# EAGLE board airlight (EAGLE 6.4)
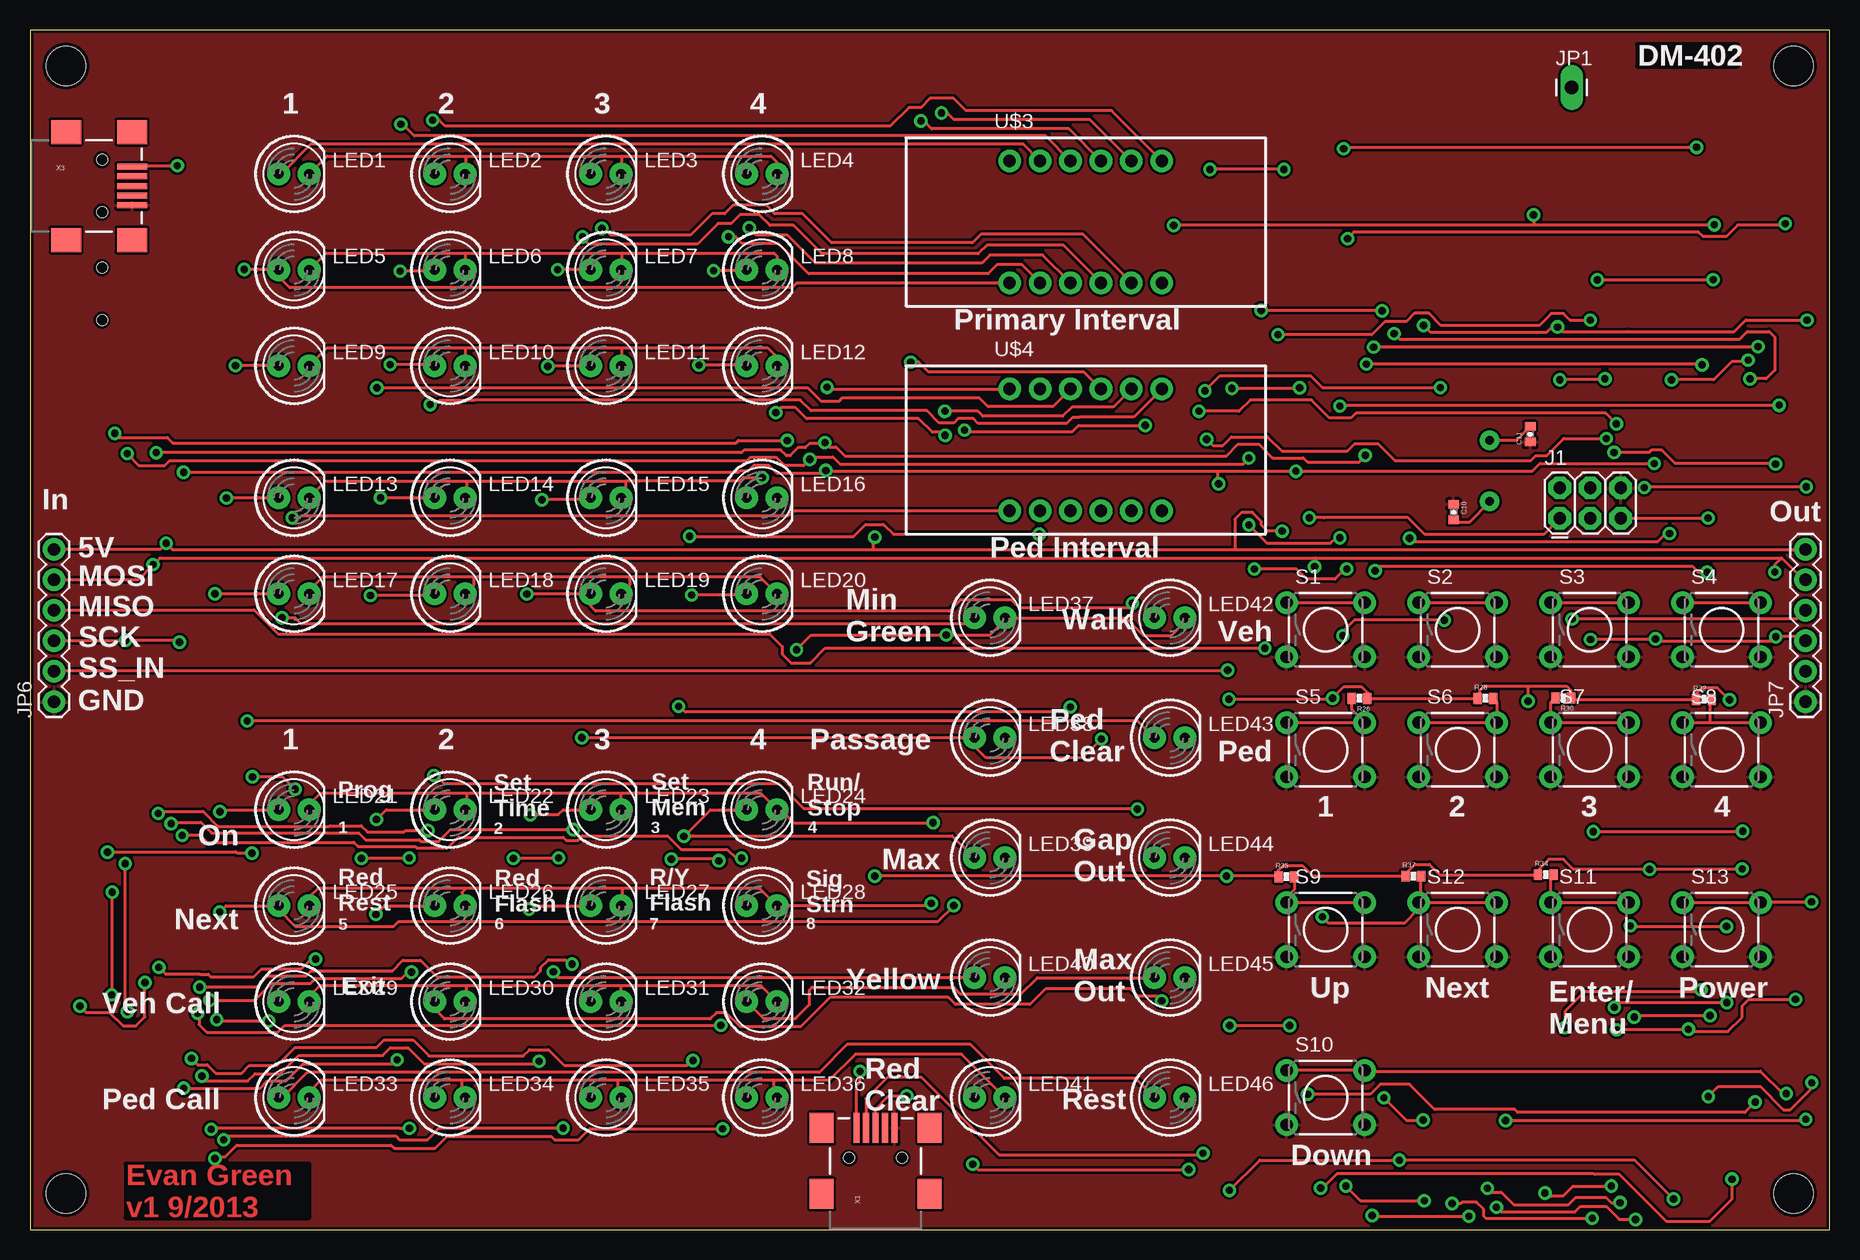
[diagram p3: board, top side]
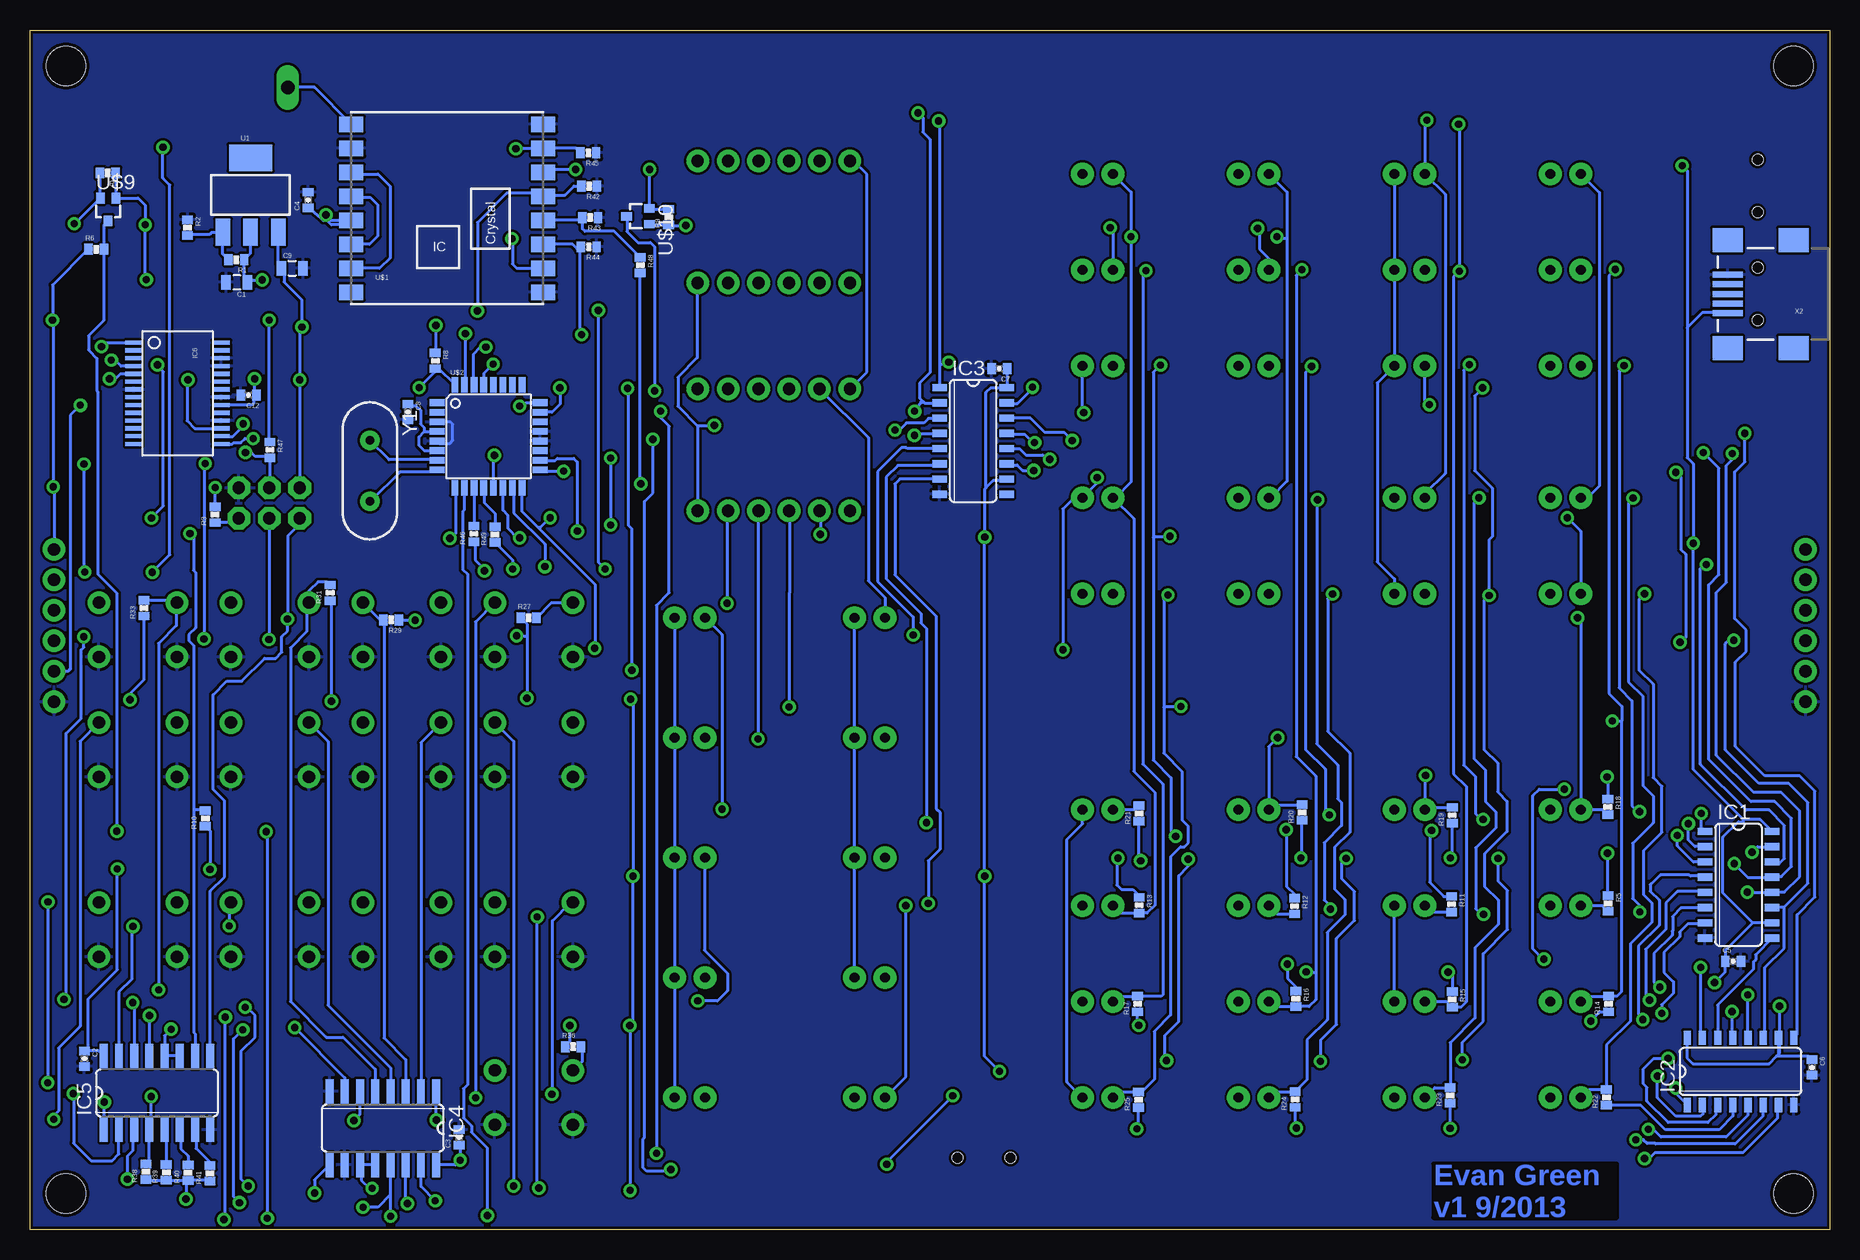
[diagram p4: board, bottom side, seen from below]

Size 150 x 100 mm. Coordinates in mm from the lower left corner, seen from the top.
Outline: 0,0 150,0 150,100 0,100 0,0
Copper layers (1*16): Top 0.035mm / dielectric 1.5mm / Bottom 0.035mm
Design rules "SparkFun": minimum track width 8mil, minimum drill 20mil, track to track 8mil, track to pad 8mil, pad to pad 8mil, via to via 8mil, smd to smd 8mil, copper to edge 10mil, drill to drill 8mil, minimum pad ring 12mil, minimum via ring 10mil, stop-mask expansion 4mil, vias tented up to drill 25mil, thermal gap 10mil

## Footprints (pad centres in the part's own frame; a part is rotated, then mirrored left to right if it is on the bottom)
0805 = smd 0.8 x 1.2: 1 -0.9,0; 2 0.9,0
0402-CAP = smd 0.7 x 0.9: 1 -0.65,0; 2 0.65,0
SO16 = smd 0.6 x 1.2: 1 -4.445,-2.8; 2 -3.175,-2.8; 3 -1.905,-2.8; 4 -0.635,-2.8; 5 0.635,-2.8; 6 1.905,-2.8; 7 3.175,-2.8; 8 4.445,-2.8; 9 4.445,2.8; 10 3.175,2.8; 11 1.905,2.8; 12 0.635,2.8; 13 -0.635,2.8; 14 -1.905,2.8; 15 -3.175,2.8; 16 -4.445,2.8
SO16' = smd 0.66 x 2.032: 1 -4.445,-3.073; 2 -3.175,-3.073; 3 -1.905,-3.073; 4 -0.635,-3.073; 5 0.635,-3.073; 6 1.905,-3.073; 7 3.175,-3.073; 8 4.445,-3.073; 9 4.445,3.073; 10 3.175,3.073; 11 1.905,3.073; 12 0.635,3.073; 13 -0.635,3.073; 14 -1.905,3.073; 15 -3.175,3.073; 16 -4.445,3.073
SSOP28DB = smd 0.348 x 1.397: 1 -4.225,-3.656; 2 -3.575,-3.656; 3 -2.925,-3.656; 4 -2.275,-3.656; 5 -1.625,-3.656; 6 -0.975,-3.656; 7 -0.325,-3.656; 8 0.325,-3.656; 9 0.975,-3.656; 10 1.625,-3.656; 11 2.275,-3.656; 12 2.925,-3.656; 13 3.575,-3.656; 14 4.225,-3.656; 15 4.225,3.656; 16 3.575,3.656; 17 2.925,3.656; 18 2.275,3.656; 19 1.625,3.656; 20 0.975,3.656; 21 0.325,3.656; 22 -0.325,3.656; 23 -0.975,3.656; 24 -1.625,3.656; 25 -2.275,3.656; 26 -2.925,3.656; 27 -3.575,3.656; 28 -4.225,3.656
2X3 = drill 1.016 pad 1.88 octagon: 1 0,0; 2 0,2.54; 3 2.54,0; 4 2.54,2.54; 5 5.08,0; 6 5.08,2.54
1X01_LONGPAD = drill 1.118 pad 1.88 long: 1 0,0
STAND-OFF = hole 3.302: 0,0
1X06 = drill 1.016 pad 1.88: 1 0,0; 2 2.54,0; 3 5.08,0; 4 7.62,0; 5 10.16,0; 6 12.7,0
LED5MM = drill 0.813 pad 1.88: A -1.27,0; K 1.27,0
0402-RES = smd 0.7 x 0.9: 1 -0.65,0; 2 0.65,0
TACTILE-PTH = drill 1.016 pad 1.88: 1 -3.251,2.261; 2 3.251,2.261; 3 -3.251,-2.261; 4 3.251,-2.261
SOT223 = smd 1.219 x 2.235: 1 -2.311,-3.099; 2 0,-3.099; 3 2.311,-3.099 | smd 3.6 x 2.2: 4 0,3.099
RFM22-XXX-S2 = smd 2 x 1.3: 1 -8,7; 2 -8,5; 3 -8,3; 4 -8,1; 5 -8,-1; 6 -8,-3; 7 -8,-5; 8 -8,-7; 9 8,-7; 10 8,-5; 11 8,-3; 12 8,-1; 13 8,1; 14 8,3; 15 8,5; 16 8,7
TQFP32-08 = smd 1.27 x 0.559: 1 -4.293,2.8; 2 -4.293,2; 3 -4.293,1.2; 4 -4.293,0.4; 5 -4.293,-0.4; 6 -4.293,-1.2; 7 -4.293,-2; 8 -4.293,-2.8; 17 4.293,-2.8; 18 4.293,-2; 19 4.293,-1.2; 20 4.293,-0.4; 21 4.293,0.4; 22 4.293,1.2; 23 4.293,2; 24 4.293,2.8 | smd 0.559 x 1.27: 9 -2.8,-4.293; 10 -2,-4.293; 11 -1.2,-4.293; 12 -0.4,-4.293; 13 0.4,-4.293; 14 1.2,-4.293; 15 2,-4.293; 16 2.8,-4.293; 25 2.8,4.293; 26 2,4.293; 27 1.2,4.293; 28 0.4,4.293; 29 -0.4,4.293; 30 -1.2,4.293; 31 -2,4.293; 32 -2.8,4.293
FUTURLEC_SMALL_7SEG_4DIGIT_CC = drill 1.016 pad 1.88: 1 -6.35,-5.08; 2 -3.81,-5.08; 3 -1.27,-5.08; 4 1.27,-5.08; 5 3.81,-5.08; 6 6.35,-5.08; 7 6.35,5.08; 8 3.81,5.08; 9 1.27,5.08; 10 -1.27,5.08; 11 -3.81,5.08; 12 -6.35,5.08
SOT-323 = smd 0.7 x 0.9: 1 0.65,0.95; 2 -0.65,0.95; 3 0,-0.95
USB-MINIB = smd 2.5 x 0.5: D+ 2.5,0; D- 2.5,0.8; GND 2.5,-1.6; ID 2.5,-0.8; VBUS 2.5,1.6 | smd 2.5 x 2: MTN1 -3,4.5; MTN2 2.5,4.5; MTN3 -3,-4.5; MTN4 2.5,-4.5 | hole 0.9: 0,2.2; 0,-2.2
HC49US = drill 0.7 pad 1.651: 1 -2.54,0; 2 2.54,0

## Placement (x,y rotation side)
C1  10uF  [0805]  132.76,78.96 180 bottom
C2  0.1uF  [0402-CAP]  145.46,14.24 270 bottom
C3  0.1uF  [0402-CAP]  114.23,7.68 90 bottom
C4  0.1uF  [0402-CAP]  126.81,85.83 90 bottom
C5  0.1uF  [0402-CAP]  8.04,22.35 0 bottom
C6  0.1uF  [0402-CAP]  1.46,13.52 270 bottom
C7  0.1uF  [0402-CAP]  69.2,71.77 180 bottom
C8  0.1uF  [0402-CAP]  118.5,68.16 270 bottom
C9  10uF  [0805]  128.15,80.13 0 bottom
C10  18pF  [0402-CAP]  118.66,59.81 270 top
C11  18pF  [0402-CAP]  125.05,66.31 90 top
C12  0.1uF  [0402-CAP]  131.78,69.56 180 bottom
IC1  74LS595D  [SO16]  7.58,28.74 270 bottom
IC2  74LS595D  [SO16]  7.42,13.18 0 bottom
IC3  74LS595D  [SO16]  71.38,65.74 270 bottom
IC4  74HC589D  [SO16']  120.59,8.45 180 bottom
IC5  74HC589D  [SO16']  139.41,11.39 0 bottom
IC6  FT232RLSSOP  [SSOP28DB]  137.7,69.71 270 bottom
J1  AVR_SPI_PRG_6PTH  [2X3]  127.52,59.29 0 top
JP1  M01PTH_LONGPAD  [1X01_LONGPAD]  128.51,95.21 0 top
JP2  STAND-OFF  [STAND-OFF]  3,3 0 top
JP3  STAND-OFF  [STAND-OFF]  3,97 0 top
JP4  STAND-OFF  [STAND-OFF]  147,3 0 top
JP5  STAND-OFF  [STAND-OFF]  147,97 0 top
JP6  IF_IN  [1X06]  2,44 90 top
JP7  IF_OUT  [1X06]  148,44 90 top
LED1  [LED5MM]  22,88 0 top
LED2  [LED5MM]  35,88 0 top
LED3  [LED5MM]  48,88 0 top
LED4  [LED5MM]  61,88 0 top
LED5  [LED5MM]  22,80 0 top
LED6  [LED5MM]  35,80 0 top
LED7  [LED5MM]  48,80 0 top
LED8  [LED5MM]  61,80 0 top
LED9  [LED5MM]  22,72 0 top
LED10  [LED5MM]  35,72 0 top
LED11  [LED5MM]  48,72 0 top
LED12  [LED5MM]  61,72 0 top
LED13  [LED5MM]  22,61 0 top
LED14  [LED5MM]  35,61 0 top
LED15  [LED5MM]  48,61 0 top
LED16  [LED5MM]  61,61 0 top
LED17  [LED5MM]  22,53 0 top
LED18  [LED5MM]  35,53 0 top
LED19  [LED5MM]  48,53 0 top
LED20  [LED5MM]  61,53 0 top
LED21  [LED5MM]  22,35 0 top
LED22  [LED5MM]  35,35 0 top
LED23  [LED5MM]  48,35 0 top
LED24  [LED5MM]  61,35 0 top
LED25  [LED5MM]  22,27 0 top
LED26  [LED5MM]  35,27 0 top
LED27  [LED5MM]  48,27 0 top
LED28  [LED5MM]  61,27 0 top
LED29  [LED5MM]  22,19 0 top
LED30  [LED5MM]  35,19 0 top
LED31  [LED5MM]  48,19 0 top
LED32  [LED5MM]  61,19 0 top
LED33  [LED5MM]  22,11 0 top
LED34  [LED5MM]  35,11 0 top
LED35  [LED5MM]  48,11 0 top
LED36  [LED5MM]  61,11 0 top
LED37  [LED5MM]  80,51 0 top
LED38  [LED5MM]  80,41 0 top
LED39  [LED5MM]  80,31 0 top
LED40  [LED5MM]  80,21 0 top
LED41  [LED5MM]  80,11 0 top
LED42  [LED5MM]  95,51 0 top
LED43  [LED5MM]  95,41 0 top
LED44  [LED5MM]  95,31 0 top
LED45  [LED5MM]  95,21 0 top
LED46  [LED5MM]  95,11 0 top
R1  240  [0402-RES]  132.8,80.85 180 bottom
R2  390  [0402-RES]  136.87,83.53 270 bottom
R3  10k  [0402-RES]  134.57,59.59 90 bottom
R5  150  [0402-RES]  18.46,27.18 270 bottom
R6  10k  [0402-RES]  144.49,81.72 0 bottom
R7  10k  [0402-RES]  143.51,88.09 180 bottom
R8  10k  [0402-RES]  116.22,72.42 270 bottom
R9  10k  [0402-RES]  96.76,84.41 90 bottom
R10  10k  [0402-RES]  135.39,34.27 90 bottom
R11  150  [0402-RES]  31.5,27.12 270 bottom
R12  150  [0402-RES]  44.58,26.96 270 bottom
R13  150  [0402-RES]  57.54,27.04 270 bottom
R14  150  [0402-RES]  18.42,18.8 90 bottom
R15  150  [0402-RES]  31.44,19.18 270 bottom
R16  150  [0402-RES]  44.48,19.24 270 bottom
R17  150  [0402-RES]  57.68,18.8 90 bottom
R18  150  [0402-RES]  18.48,35.24 270 bottom
R19  150  [0402-RES]  31.44,34.54 90 bottom
R20  150  [0402-RES]  43.96,34.76 90 bottom
R21  150  [0402-RES]  57.56,34.68 90 bottom
R22  150  [0402-RES]  18.6,11.02 90 bottom
R23  150  [0402-RES]  31.62,11.18 90 bottom
R24  150  [0402-RES]  44.54,10.84 90 bottom
R25  150  [0402-RES]  57.6,10.82 90 bottom
R26  100k  [0402-RES]  110.82,44.28 180 top
R27  100k  [0402-RES]  108.44,51 0 bottom
R28  100k  [0402-RES]  121.3,44.28 0 top
R29  100k  [0402-RES]  119.9,50.82 180 bottom
R30  100k  [0402-RES]  127.8,44.32 180 top
R31  100k  [0402-RES]  124.98,53.08 90 bottom
R32  100k  [0402-RES]  139.54,44.2 0 top
R33  100k  [0402-RES]  140.5,51.8 90 bottom
R34  100k  [0402-RES]  126.34,29.58 0 top
R35  100k  [0402-RES]  104.72,29.4 0 top
R36  100k  [0402-RES]  104.74,15.24 0 bottom
R37  100k  [0402-RES]  115.3,29.46 0 top
R38  100k  [0402-RES]  140.34,4.82 90 bottom
R39  100k  [0402-RES]  138.64,4.76 90 bottom
R40  100k  [0402-RES]  136.82,4.74 90 bottom
R41  100k  [0402-RES]  135,4.68 90 bottom
R42  20k  [0402-RES]  103.4,86.98 180 bottom
R43  20k  [0402-RES]  103.3,84.36 180 bottom
R44  20k  [0402-RES]  103.42,81.92 180 bottom
R45  20k  [0402-RES]  103.46,89.76 180 bottom
R46  10k  [0402-RES]  113,58 90 bottom
R47  10k  [0402-RES]  130,65 270 bottom
R48  10k  [0402-RES]  99.14,80.4 270 bottom
R49  10k  [0402-RES]  111.24,57.94 90 bottom
S1  PED1  [TACTILE-PTH]  108,50 0 top
S2  PED2  [TACTILE-PTH]  119,50 0 top
S3  PED3  [TACTILE-PTH]  130,50 0 top
S4  PED4  [TACTILE-PTH]  141,50 0 top
S5  VEH1  [TACTILE-PTH]  108,40 0 top
S6  VEH2  [TACTILE-PTH]  119,40 0 top
S7  VEH3  [TACTILE-PTH]  130,40 0 top
S8  VEH4  [TACTILE-PTH]  141,40 0 top
S9  [TACTILE-PTH]  108,25 0 top
S10  [TACTILE-PTH]  108,11 0 top
S11  [TACTILE-PTH]  130,25 0 top
S12  [TACTILE-PTH]  119,25 0 top
S13  [TACTILE-PTH]  141,25 0 top
U1  V_REG_317SMD  [SOT223]  131.61,86.24 0 bottom
U$1  RFM22SMD  [RFM22-XXX-S2]  115.21,85.14 0 bottom
U$2  AVR-MEGA8-AI  [TQFP32-08]  111.78,66.13 0 bottom
U$3  FUTURLEC_SMALL_7SEG_4DIGIT_CC0.36"  [FUTURLEC_SMALL_7SEG_4DIGIT_CC]  88,84 0 top
U$4  FUTURLEC_SMALL_7SEG_4DIGIT_CC0.36"  [FUTURLEC_SMALL_7SEG_4DIGIT_CC]  88,65 0 top
U$9  BSS138  [SOT-323]  143.49,85.04 0 bottom
U$10  BSS138  [SOT-323]  99.33,84.46 270 bottom
X1  USBSMD  [USB-MINIB]  70.48,5.96 90 top
X2  USBSMD  [USB-MINIB]  6,78 180 bottom
X3  USBSMD  [USB-MINIB]  6,87 0 top
Y1  16MHz  [HC49US]  121.67,63.25 270 bottom

## Tracks (layer width: path | path; a pad name or v marks a point on that pad's centre or on a via)
3.3V  (via drill 0.6)
  Top 0.254: v95.34,83.7 95.4,83.76 125.34,83.76 | 125.34,83.76 v140.4,83.76 | v125.34,84.58 125.34,83.76 | v130.64,79.16 130.66,79.18 v140.3,79.18
  Bottom 0.254: U$10.1 98.33,83.76 R9.1 96.7,83.7 v95.34,83.7 | v140.4,83.76 140.14,84.02 | R7.1 142.84,88.07 U$9.1 141,86 140.4,85.4 v140.4,83.76 | C4.1 125.57,84.14 U$1.5 123.59,83.76 124.88,83.76 125.34,84.22 v125.34,84.58 | U1.2 131.61,81.39 R1.1 132.15,79.25 C1.1 131.66,79.16 v130.64,79.16 | v140.3,79.18 140.4,79.28 v140.4,83.76
3V_IRQ  (via drill 0.6)
  Top 0.254: v104.52,88.38 v98.36,88.38
  Bottom 0.254: R9.2 98.33,85.06 U$10.2 98.38,88.36 v98.36,88.38 | U$1.14 106.97,88.38 v104.52,88.38
3V_MISO  (via drill 0.6)
  Top 0.254: v146.32,83.86 146.2,83.74 142.34,83.74 141.38,82.78 139.46,82.78 139.08,83.16 110.34,83.16 109.84,82.66 v109.84,82.6
  Bottom 0.254: R7.2 144.16,86.01 U$9.2 146.27,83.86 v146.32,83.86 | v109.84,82.6 109.78,82.54 109.78,80.5 109.42,80.14 U$1.10
5V  (via drill 0.6)
  Top 0.254: JP6.6 10.86,56.7 v11.36,57.2 11.86,56.7 70.28,56.7 | v4.16,18.62 4.66,18.12 6.62,18.12 7.78,16.96 8.82,16.96 9.58,17.72 v9.58,20.58 | 70.28,56.7 100.42,56.7 | 100.42,56.7 JP7.6 | v104.38,58.22 103.16,58.22 102.64,58.74 102.64,59.04 101.9,59.78 100.98,59.78 100.42,59.22 100.42,56.7 | v134.56,61.86 134.62,61.92 v148.06,61.92 | v116.16,75.38 116.74,74.8 126.42,74.8 126.86,75.24 v127.34,75.24 127.74,74.84 133.14,74.84 133.16,74.86 142.08,74.86 143.04,75.82 v148.12,75.82 | X1.VBUS 68.88,11.98 69.18,12.28 v69.18,13.18 | v70.42,57.72 70.28,57.58 70.28,56.7 | v70.42,29.46 v99.74,29.46 104.01,29.46 R35.1 104.06,29.94 104.46,30.34 106.06,30.34 106.94,29.46 R37.1 114.8,29.61 114.8,29.8 115.44,30.44 116.66,30.44 117.52,29.58 R34.1 125.69,29.95 126.6,30.86 127.82,30.86 128.66,30.02 v135,30.02 142.68,30.02 v142.72,30.06 | 124.9,45.3 121.22,45.3 120.84,44.92 120.84,44.47 R28.1 R26.1 111.47,44.77 110.98,45.26 109.54,45.26 v108.58,44.3 108.48,44.2 v99.94,44.2 | 124.9,45.3 128.1,45.3 128.45,44.95 R30.1 128.57,44.2 R32.1 138.89,44.69 139.36,45.16 140.66,45.16 v141.66,44.16 | v117.9,50.8 110.38,50.8 109.44,49.86 v109.44,49.5 | v124.88,44.04 124.9,44.06 124.9,45.3 | v105,17 v100,17 | v99.98,3.26 102.5,5.78 v114.14,5.78 133.76,5.78 v137,2.54 | v131.28,70.92 131.2,70.84 v127.52,70.84 | X3.VBUS 8.58,88.68 v12.28,88.68
  Bottom 0.254: IC2.16 11.88,15.96 11.88,14.32 11.38,13.82 5.04,13.82 4.43,14.43 | 4.43,14.43 4.25,14.62 | 4.25,14.62 IC2.10 | IC1.16 5.78,34.18 7.18,34.18 | 7.18,34.18 11.36,38.36 v11.36,57.2 11.36,63.84 11.86,64.34 11.86,75.18 | IC1.10 4.79,25.58 6.4,25.58 | 7.18,34.18 7.18,34 7.6,34 8.88,32.72 8.88,28.06 6.4,25.58 | 6.4,25.58 8.69,23.29 C5.1 8.69,21.47 v9.58,20.58 | 4.25,14.62 4.16,14.7 v4.16,18.62 | C7.1 68.58,71.74 IC3.16 69.92,70.19 70.3,69.8 70.3,61.84 | U$2.18 107.46,64.1 106.24,64.1 106.06,64.28 104.68,64.28 104.38,63.98 v104.38,58.22 | R3.2 v134.56,61.86 | JP7.6 148,61.86 v148.06,61.92 148.06,75.76 v148.12,75.82 148.12,78.74 R6.1 | R8.1 116.16,73.13 v116.16,75.38 | J1.2 v127.52,70.84 127.52,75.06 v127.34,75.24 127.34,77.52 128.82,79 128.82,79.9 C9.1 129.3,80.38 U1.3 | v69.18,13.18 70.42,14.42 v70.42,29.46 v70.42,57.72 70.42,61.72 70.3,61.84 | R27.1 108.58,50.49 108.58,49.5 | 108.58,49.5 v108.58,44.3 | R29.1 119.23,50.8 v117.9,50.8 | v109.44,49.5 108.58,49.5 | R31.1 124.88,52.33 v124.88,44.04 | R33.1 140.54,51.11 140.54,45.8 141.66,44.68 v141.66,44.16 | v99.94,44.2 99.74,44 v99.74,29.46 99.74,17.26 v100,17 99.98,16.98 v99.98,3.26 | R38.1 140.28,4.11 R39.1 138.62,4.09 R40.1 | R41.1 135.06,4.09 R40.1 | v142.72,30.06 142.72,21.66 145.16,19.22 145.16,15.19 C2.1 144.28,14.89 IC5.16 | R10.1 135,33.23 v135,30.02 | IC3.10 68.72,62.42 69.72,62.42 70.3,61.84 | R36.1 105,15.63 v105,17 | IC4.16 114.54,5.38 v114.14,5.78 114.14,6.94 C3.1 | R40.1 137,3.91 v137,2.54 | IC6.20 131.49,68.73 131.34,68.88 131.34,69.35 C12.1 131.28,69.71 v131.28,70.92 | C6.1 1.72,14.43 4.43,14.43 | X2.VBUS 8.54,76.44 10.6,76.44 11.86,75.18
  Bottom 0.254: v12.28,88.68 11.86,88.26 11.86,75.18
5V_MISO  (via drill 0.6)
  Top 0.254: v142.76,33.2 142.72,33.16 v130.32,33.16 | v130.22,0.94 130.18,0.9 121.4,0.9 121.18,1.12 121.18,1.68 120.58,2.28 119.38,2.28 119.26,2.16 v118.54,2.16
  Bottom 0.254: U$9.3 143.84,83.74 R6.2 143.86,81.7 143.86,75.78 145.12,74.52 145.12,73.32 144.42,72.62 144.42,69.9 144.34,69.82 144.34,54.64 142.76,53.06 v142.76,33.2 | v130.32,33.16 130.22,33.06 v130.22,0.94 | v118.54,2.16 118.69,2.31 IC4.14
CLK  (via drill 0.6)
  Top 0.254: v12.8,63.12 59.06,63.12 59.16,63.22 59.84,63.22 60.3,63.68 61.62,63.68 62.26,63.04 66.1,63.04 v66.34,63.28 66.4,63.22 99,63.22 | JP6.3 7.94,49.08 v7.98,49.12 12.3,49.12 v12.46,48.96 | 99,63.22 v105.52,63.22 125.22,63.22 125.86,63.86 v135.4,63.86 | v130.08,49.18 130.14,49.24 v135.5,49.24 135.66,49.08 145.18,49.08 v145.52,49.42 147.66,49.42 JP7.3 | v99.08,62.16 99,62.2 99,63.22 | v121.48,3.44 121.8,3.12 122.64,3.12 123.68,2.08 128.24,2.08 128.84,2.68 131.36,2.68 131.8,2.24 v132.54,2.24 | v132.26,16.64 132.32,16.7 v138.24,16.7 138.42,16.52 141.54,16.52 142.72,17.7 142.72,18.64 143.26,19.18 v147.16,19.18
  Bottom 0.254: IC3.11 68.48,63.74 67.72,63.74 67.26,63.28 v66.34,63.28 | IC1.11 4.74,26.88 3.78,26.88 | 3.78,26.88 1.8,28.86 1.8,35.6 3.4,37.2 5.88,37.2 8.68,40 8.68,48.84 8.4,49.12 v7.98,49.12 | v12.8,63.12 12.38,62.7 12.38,56.68 12,56.3 12,49.34 12.38,48.96 v12.46,48.96 | IC2.11 5.38,16.11 5.38,21.84 3.78,23.44 3.78,26.88 | v135.4,63.86 135.5,63.76 v135.5,49.24 | U$2.17 107.38,63.22 v105.52,63.22 | J1.3 130.08,59.27 v130.08,49.18 | 98.96,79.57 R48.2 99.14,62.22 v99.08,62.16 | IC4.12 IC4.11 122.38,5.26 122.38,4.12 121.7,3.44 v121.48,3.44 | v132.54,2.24 133.04,2.74 133.04,15.9 132.3,16.64 v132.26,16.64 | v138.24,16.7 138.78,16.16 IC5.12 IC5.11 | v147.16,19.18 146.98,19.36 146.98,41.36 145.74,42.6 145.74,48.32 145.52,48.54 v145.52,49.42
COL1  (via drill 0.6)
  Top 0.254: v66.44,70.22 66.58,70.08 U$4.12
  Bottom 0.254: IC3.15 68.53,68.86 67.7,68.86 66.44,70.12 v66.44,70.22 | U$4.12 80.24,71.49 80.24,87.96 81.36,89.08 U$3.12
COL2  (via drill 0.6)
  Top 0.254: U$3.9 86.59,91.76 75.16,91.76 74.5,92.42 v74.26,92.42 | U$4.9 87.85,71.5 74.9,71.5 74.08,72.32 v73.42,72.32
  Bottom 0.254: v74.26,92.42 74.18,92.34 74.18,72.1 | 74.18,72.1 IC3.1 | v73.42,72.32 73.64,72.1 74.18,72.1
COL3  (via drill 0.6)
  Top 0.254: U$3.8 88.35,92.54 77,92.54 76.46,93.08 v75.98,93.08 | U$4.8 90.31,68.58 86.86,68.58 86.08,67.8 79.42,67.8 79,68.22 v76.26,68.22
  Bottom 0.254: v75.98,93.08 75.58,92.68 75.58,91.48 74.98,90.88 74.98,71.42 75.84,70.56 75.84,69.3 75.52,68.98 | 75.52,68.98 75.45,68.92 IC3.2 | v76.26,68.22 75.74,68.98 75.52,68.98
COL4  (via drill 0.6)
  Top 0.254: v77.9,66.64 78.1,66.54 86.9,66.54 87.4,67.04 v92.96,67.04
  Bottom 0.254: U$3.6 94.38,78.89 94.38,72.68 96,71.06 96,68.64 94.35,66.99 | 94.35,66.99 U$4.6 | IC3.3 74.2,67.62 75.12,67.62 75.5,67.24 76.94,67.24 77.44,66.74 v77.9,66.64 | v92.96,67.04 92.51,66.99 94.35,66.99
COL5  (via drill 0.6)
  Top 0.254: LED1.K 24.77,89.5 36.34,89.5 | 36.34,89.5 49.34,89.5 | 49.34,89.5 61.76,89.5 62.27,88.99 LED4.K | LED3.K 49.34,88.07 49.34,89.5 | LED2.K 36.34,88.07 36.34,89.5 | LED5.K 24.67,81.4 36.3,81.4 | 36.3,81.4 49.36,81.4 | 49.36,81.4 62.02,81.4 62.27,81.15 LED8.K | LED7.K 49.36,80.09 49.36,81.4 | LED6.K 36.3,80.03 36.3,81.4 | LED9.K 24.79,73.52 36.32,73.52 | 36.32,73.52 49.34,73.52 | 49.34,73.52 61.46,73.52 62.27,72.71 LED12.K | LED11.K 49.34,72.07 49.34,73.52 | LED10.K 36.32,72.05 36.32,73.52 | LED20.K 60.87,54.4 50,54.4 | 50,54.4 37,54.4 | 37,54.4 24.38,54.4 23.27,53.29 LED17.K | LED18.K 37,53.73 37,54.4 | LED19.K 50,53.73 50,54.4 | v76.28,66.2 76.02,66.46 75.22,66.46 74.08,67.6 64.74,67.6 63.8,68.54 62.58,68.54 62.34,68.3 v62.16,68.1
  Bottom 0.254: LED2.K LED6.K LED10.K 37.7,70.57 37.7,55.66 36.27,54.23 LED18.K | IC3.4 74.23,66.32 75.78,66.32 75.9,66.2 v76.28,66.2 | v62.16,68.1 62.27,68.31 LED12.K
COL6  (via drill 0.6)
  Top 0.254: LED13.K 24.65,62.38 36.44,62.38 | 36.44,62.38 49.68,62.38 | LED15.K 49.68,61.41 49.68,62.38 | LED14.K 36.44,61.17 36.44,62.38 | v63.9,48.34 65.12,49.56 v76.38,49.56 80.02,49.56 81.27,50.81 | 81.27,50.81 LED37.K | 96.22,51 LED42.K 96.27,50.67 95.14,49.54 92.8,49.54 91.36,50.98 81.44,50.98 81.27,50.81 | 49.68,62.38 49.72,62.42 59.18,62.42 59.45,62.69 v61.05,62.69
  Bottom 0.254: v63.9,48.34 63.9,60.08 62.98,61 LED16.K 61.05,62.22 v61.05,62.69 | LED42.K LED43.K LED44.K LED45.K LED46.K | LED40.K LED39.K LED38.K LED37.K | IC3.5 74.19,65.12 76.88,65.12 76.94,65.18 77.34,65.18 79.34,63.18 79.34,54.04 76.38,51.08 v76.38,49.56
COL7  (via drill 0.6)
  Top 0.254: LED41.K 77.65,14.62 68.8,14.62 66.6,12.42 62,12.42 | 62,12.42 49,12.42 | 49,12.42 36,12.42 | 36,12.42 24.24,12.42 23.27,11.45 LED33.K | LED34.K 36,11.27 36,12.42 | LED35.K 49,11.27 49,12.42 | LED36.K 62,11.27 62,12.42 | 49.28,36.34 60.93,36.34 LED24.K 62.6,35 63.74,33.86 75.22,33.86 v75.28,33.92 | 49.28,36.34 36.42,36.34 | 36.42,36.34 24.18,36.34 23.27,35.43 LED21.K | LED22.K 36.42,35.15 36.42,36.34 | LED23.K 49.28,36.34
  Bottom 0.254: LED36.K 63.56,12.29 63.56,32.54 62.27,33.83 LED24.K | IC3.6 74.31,63.7 77.66,63.7 78.64,62.72 78.64,54.26 75.74,51.36 75.74,50.58 75.28,50.12 v75.28,33.92
COL8  (via drill 0.6)
  Top 0.254: 49.4,28.44 60.83,28.44 LED28.K 74.94,27 v75.12,27.18 | 49.4,28.44 36.34,28.44 | 36.34,28.44 24,28.44 23.27,27.71 LED25.K | LED27.K 49.4,27.13 49.4,28.44 | LED32.K 60.95,20.32 49.28,20.32 | 49.28,20.32 36.38,20.32 | 36.38,20.32 24.14,20.32 23.27,19.45 LED29.K | LED30.K 36.38,19.11 36.38,20.32 | LED31.K 49.28,20.32 | 36.34,28.44 36,28.1 36,27 LED26.K
  Bottom 0.254: IC3.7 74.19,62.58 77.48,62.58 77.9,62.16 77.9,54.58 74.46,51.14 74.46,35.08 74.16,34.78 74.16,31.7 75.12,30.74 v75.12,27.18 | LED30.K LED26.K
DMINUS  (via drill 0.6)
  Top 0.254: v132.24,67.16 131.34,68.06 110.5,68.06 110.1,67.66 108.32,67.66 106.82,69.16 101.72,69.16 100.78,68.22 v97.44,68.22 | v97.78,6.36 97.62,6.2 80.8,6.2 74.3,12.7 71.48,12.7 69.68,10.9 X1.D-
  Bottom 0.254: IC6.16 134.03,66.12 133.1,66.12 132.24,66.98 v132.24,67.16 | 97.26,68.04 v97.44,68.22 97.44,67.68 96.72,66.96 96.72,53.1 97.78,52.04 v97.78,6.36
DOWN  (via drill 0.6)
  Top 0.254: v146.4,11.34 146.1,11.34 144.24,13.2 111.31,13.2 S10.2 S10.1
  Bottom 0.254: v146.4,11.34 146.36,11.3 146.36,7.2 144.9,5.74 143.14,5.74 142.59,6.29 IC5.2 | R36.2 104,15.15 104,14 S10.1
DPLUS  (via drill 0.6)
  Top 0.254: X1.D+ 70.48,10.04 71.58,11.14 v73.08,11.14 | v78.58,5.44 79.02,5 v96.58,5 | v98.08,65.88 98.6,65.36 99.42,65.36 100.14,66.08 103.16,66.08 104.34,64.9 109.8,64.9 110.42,65.52 112.36,65.52 113.76,64.12 125.12,64.12 125.52,64.52 126.42,64.52 127.84,65.94 v131.4,65.94
  Bottom 0.254: v73.08,11.14 78.58,5.64 v78.58,5.44 | v96.58,5 96.72,4.86 98.6,4.86 98.88,5.14 98.88,7.56 98.78,7.66 98.78,60.7 98.08,61.4 v98.08,65.88 | IC6.15 134.03,65.5 133.14,65.5 133.04,65.6 132.42,65.6 132.08,65.94 v131.4,65.94
ENTER  (via drill 0.6)
  Top 0.254: S12.1 S12.2 | S12.1 115.95,27.46 R37.2 | v107.58,3.46 107.76,3.46 108.94,4.64 130.36,4.64 130.4,4.6 132.48,4.6 136.38,0.7 140.02,0.7 141.88,2.56 v141.88,4.2 | v107.72,26.06 108.2,25.58 114.62,25.58 115.75,26.71 S12.1
  Bottom 0.254: IC5.3 141.44,8.19 141.44,6.56 141.88,6.12 v141.88,4.2 | v107.58,3.46 107.72,3.6 v107.72,26.06
GND
  Bottom 0.254: U$2.5 115.88,65.54 115.02,65.54 114.76,65.8 114.76,67.14 114.95,67.33 U$2.3
  pour Bottom: 0,0 150,0 150,100 0,100
  pour Top: 0,0 150,0 150,100 0,100
GRN1  (via drill 0.6)
  Top 0.254: LED9.A 20.71,72.02 v17.12,72.02 | v15.84,34.84 16,35 LED21.A | LED37.A 78.23,50.5 22.62,50.5 22.12,51 v21,51
  Bottom 0.254: v17.12,72.02 17.54,71.6 17.54,45.16 16.46,44.08 16.46,35.32 15.98,34.84 v15.84,34.84 | v21,51 20.73,50.73 LED21.A 18.89,35 R18.2 | U$4.11 80.12,66.01 80.12,54.08 78.73,52.69 LED37.A
GRN2  (via drill 0.6)
  Top 0.254: LED10.A 33.63,72.1 v30.02,72.1 | v28.88,34.18 29.7,35 LED22.A | U$4.7 92.01,67.74 87.48,67.74 87.44,67.7 86.9,67.7 86.4,67.2 79.04,67.2 78.64,67.6 77.36,67.6 77,67.24 75.78,67.24 74.76,68.26 65.1,68.26 64.2,69.16 37.08,69.16 37.04,69.12 34.12,69.12 33.76,68.76 v33.36,68.76 | v92.32,35.04 92.28,35.08 64.5,35.08 62.42,37.16 34.56,37.16 33.86,37.86 v33.66,37.86
  Bottom 0.254: v30.02,72.1 30.48,71.64 30.48,38.72 29.52,37.76 29.52,34.68 29.02,34.18 v28.88,34.18 | R19.2 33.54,35.19 LED22.A 33.73,37.79 v33.66,37.86 | v33.36,68.76 33.73,69.13 LED10.A | LED42.A 92.32,49.59 v92.32,35.04
GRN3  (via drill 0.6)
  Top 0.254: LED11.A 46.69,71.96 v43.16,71.96 | v41.7,34.56 41.73,34.59 44.04,34.59 44.45,35 LED23.A | v46,41 LED38.A 78.73,40.29 79.7,39.32 87.74,39.32 v89.32,40.9
  Bottom 0.254: v43.16,71.96 43.68,71.44 43.68,40.02 42.04,38.38 42.04,34.92 41.7,34.58 v41.7,34.56 | R20.2 46.32,35.41 LED23.A 46.73,40.27 v46,41 | U$4.4 89.32,59.87 v89.32,40.9
GRN4  (via drill 0.6)
  Top 0.254: LED12.A 59.67,72.06 v55.76,72.06 | LED24.A 56.72,35 v54.5,32.78 55.22,32.78 55.26,32.82 76.86,32.82 77.68,32 77.73,32 LED39.A | 83.96,57.8 v84.12,57.96 71.96,57.96 71.14,58.78 69.66,58.78 68.64,57.76 55.02,57.76 v54.98,57.8
  Bottom 0.254: v55.76,72.06 56.36,71.46 56.36,57.72 | 56.36,57.72 56.36,39.14 54.88,37.66 54.88,33.2 54.5,32.82 v54.5,32.78 | R21.2 57.89,35 LED24.A | U$4.2 84.12,59.85 v84.12,57.96 | v54.98,57.8 55.06,57.72 56.36,57.72
GRN5  (via drill 0.6)
  Top 0.254: LED17.A v15.42,53 | LED46.A 92.13,12.6 81.22,12.6 78.4,15.42 68.12,15.42 65.8,13.1 23.12,13.1 21.02,11 LED33.A | U$4.1 81.61,59.88 63.6,59.88 63.2,59.48 22.62,59.48 22.48,59.34 v21.86,59.34
  Bottom 0.254: v15.42,53 15.88,52.54 15.88,46.64 14.7,45.46 14.7,37.68 13.96,36.94 13.96,33.12 15.48,31.6 15.48,27.9 14.78,27.2 14.78,25.64 16.58,23.84 16.58,17.4 18.6,15.38 R22.2 20.06,11.67 LED33.A 20.73,10.73 | v21.86,59.34 20.73,58.21 LED17.A
GRN6  (via drill 0.6)
  Top 0.254: LED18.A 33.59,52.86 v28.38,52.86 | U$4.10 85.25,68.6 79.86,68.6 79.16,69.3 67.68,69.3 67.42,69.04 65.96,69.04 64.84,70.16 v28.92,70.16
  Bottom 0.254: LED34.A 32.9,11.83 R23.2 31.62,15.58 29.56,17.64 29.56,23.5 27.62,25.44 27.62,27.46 28.72,28.56 28.72,31.34 26.88,33.18 26.88,35.7 27.66,36.48 27.66,38.88 28.8,40.02 28.8,52.44 v28.38,52.86 28.38,57.5 28.12,57.76 28.12,61.8 29.58,63.26 29.58,69.5 v28.92,70.16
GRN7  (via drill 0.6)
  Top 0.254: v41.42,52.98 46.71,52.98 LED19.A 46.73,51.99 47.16,51.56 76.64,51.56 77.56,52.48 81.82,52.48 82.48,51.82 91.52,51.82 v91.9,52.2
  Bottom 0.254: v41.42,52.98 41.82,52.58 41.82,41.54 40,39.72 40,33.12 41.26,31.86 41.26,28.38 40.4,27.52 40.4,26.22 41.86,24.76 41.86,17.5 43.56,15.8 43.56,12.5 44.54,11.52 R24.2 46.24,11.49 LED35.A | U$4.5 91.9,59.83 v91.9,52.2
GRN8  (via drill 0.6)
  Top 0.254: LED20.A 59.63,52.9 v55.14,52.9 | v86.72,43.56 86.3,43.14 54.62,43.14 54.16,43.6 v54.06,43.6
  Bottom 0.254: v55.14,52.9 55.5,52.54 55.5,43.56 | 55.5,43.56 55.5,39.72 53.96,38.18 53.96,34.14 53.44,33.62 53.44,32.24 53.78,31.9 54.1,31.9 54.9,31.1 54.9,30.42 54.92,30.4 54.92,17.88 56.28,16.52 56.28,12.52 57.33,11.47 R25.2 59.26,11.47 LED36.A | U$4.3 86.7,59.89 86.7,53.08 86.72,53.06 v86.72,43.56 | v54.06,43.6 54.1,43.56 55.5,43.56
IN_CAS  (via drill 0.6)
  Top 0.254: v126.28,3.04 126.52,2.8 127.8,2.8 128.62,3.62 v131.82,3.62 | v132.06,18.52 132.46,18.92 v141.44,18.92
  Bottom 0.254: IC4.9 126.28,4.13 v126.28,3.04 | v131.82,3.62 132.38,4.18 132.38,14.9 131.24,16.04 131.24,17.84 131.92,18.52 v132.06,18.52 | v141.44,18.92 141.31,18.8 IC5.14
IN_OE  (via drill 0.6)
  Top 0.254: v115,57.62 115.3,57.36 135.7,57.36 136.36,58.02 v136.66,58.02
  Bottom 0.254: U$2.9 114.54,61.8 114.54,58.02 114.9,57.62 v115,57.62 | v136.66,58.02 136.36,57.72 136.36,54.94 136.2,54.78 136.2,50.16 136.76,49.6 136.76,49.1 136.34,48.68 136.34,35 | 136.34,35 136.34,16.42 136.24,16.32 IC5.10 | R10.2 135.25,35 136.34,35
IRQ  (via drill 0.6)
  Top 0.254: v97.94,69.92 99.2,71.18 106.74,71.18 107.74,70.18 v117.56,70.18
  Bottom 0.254: U$2.32 115.93,71.77 R8.2 116.22,71.52 v117.56,70.18 | U$10.3 100.24,84.42 100.24,83.2 99.32,82.28 98.28,82.28 97.94,81.94 v97.94,69.92
LD_IN  (via drill 0.6)
  Top 0.254: v111.88,1.16 111.94,1.1 v119.94,1.1 | v122.24,1.86 122.64,1.46 128.78,1.46 129.24,1.92 131.38,1.92 132.46,0.84 v133.84,0.84 | v133.72,17.7 133.86,17.84 v140.04,17.84
  Bottom 0.254: U$2.10 113.82,61.8 113.82,59.96 113.92,59.86 113.92,55.02 113.54,54.64 113.54,12.06 113.86,11.74 113.86,9.3 113.2,8.64 113.2,8.12 111.88,6.8 v111.88,1.16 | v119.94,1.1 119.95,1.11 IC4.13 119.96,2.88 120.98,1.86 v122.24,1.86 | v133.84,0.84 133.72,0.96 v133.72,17.7 | v140.04,17.84 IC5.13
MISO  (via drill 0.6)
  Top 0.254: JP6.4 2.04,51.66 18.68,51.66 20.68,49.66 61.66,49.66 62.7,48.62 62.7,47.96 63.42,47.24 65.06,47.24 66.28,48.46 v102.94,48.46 | J1.1 126.17,57.94 116.26,57.94 114.86,59.34 107.86,59.34 107.78,59.34 v106.64,59.34 | JP7.4 147.28,50.9 v128.54,50.9
  Bottom 0.254: v102.94,48.46 102.86,48.54 102.86,53.74 107.64,58.52 | 107.64,58.52 108.98,59.86 U$2.16 | v106.64,59.34 107.46,58.52 107.64,58.52 | J1.1 127.52,58.8 128.46,57.86 128.46,50.98 v128.54,50.9 128.54,49.9 129.02,49.42 129.02,48.14 129.54,47.62 130.44,47.62 132.34,45.72 133.6,45.72 134.74,44.58 134.74,36.7 133.78,35.74 133.78,29.4 134.96,28.22 IC5.9
MODE  (via drill 0.6)
  Top 0.254: R34.2 126.75,29.34 S11.1 S11.2 | v133.4,25.32 133.46,25.26 v141.42,25.26
  Bottom 0.254: S11.2 133.4,27.11 v133.4,25.32 | v141.42,25.26 141.52,25.16 141.52,20.86 142.59,19.8 IC5.15
MOSI  (via drill 0.6)
  Top 0.254: JP6.5 9,54.16 v10.26,55.44 10.84,56 107.18,56 | 107.18,56 146,56 | 146,56 147.84,54.16 JP7.5 | v107.08,55.26 107.18,55.36 107.18,56 | 146,56 145.44,55.44 v145.44,54.82 | v145.5,63.82 145.46,63.86 137.14,63.86 136.04,64.96 135.16,64.96 134.98,64.78 v132.04,64.78
  Bottom 0.254: IC1.14 4.59,30.46 4.22,30.46 3.76,30.92 3.76,33.68 5.04,34.96 6.94,34.96 10.76,38.78 10.76,55.12 10.5,55.38 v10.26,55.44 | U$2.15 109.68,61.74 109.68,59.74 107.08,57.14 v107.08,55.26 | J1.4 130,61.89 R47.2 130.09,64.44 131.22,64.44 131.56,64.78 v132.04,64.78 | v145.44,54.82 145.5,54.88 v145.5,63.82
N$1  (via drill 0.6)
  Top 0.254: v6.46,31.46 6.5,31.5 17.14,31.5 17.26,31.38 v18.5,31.38
  Bottom 0.254: R5.1 18.5,27.87 v18.5,31.38 | v6.46,31.46 6,31.91 IC1.15
N$2  (via drill 0.6)
  Top 0.254: v10.68,34.68 10.86,34.86 14.42,34.86 15.66,33.62 24.94,33.62 24.98,33.66 27.62,33.66 28.14,33.14 31.18,33.14 31.3,33.26 v33.16,33.26
  Bottom 0.254: IC1.1 10.68,33.48 v10.68,34.68 | v33.16,33.26 33.32,33.08 33.32,28.94 32.15,27.77 R11.1
N$3  (via drill 0.6)
  Top 0.254: v11.76,33.84 11.86,33.94 14.26,33.94 15.14,33.06 27.4,33.06 27.98,32.48 32.46,32.48 32.6,32.34 34.06,32.34 35.06,33.34 v45.3,33.34
  Bottom 0.254: IC1.2 11.22,31.92 11.76,32.46 v11.76,33.84 | v45.3,33.34 45.26,33.3 45.26,28.6 44.58,27.92 R12.1
N$4  (via drill 0.6)
  Top 0.254: v12.68,32.86 12.7,32.88 14.16,32.88 14.76,32.28 26.98,32.28 27.34,31.92 32.14,31.92 32.26,31.8 34.8,31.8 35.7,32.7 44.44,32.7 44.7,32.44 45.68,32.44 46.06,32.82 53.14,32.82 54.28,31.68 58.12,31.68 58.84,30.96 v59.32,30.96
  Bottom 0.254: IC1.3 11.34,30.64 12.68,31.98 v12.68,32.86 | v59.32,30.96 59.4,30.88 59.4,28.72 59.02,28.34 58.08,28.34 57.54,27.8 R13.1
N$5  (via drill 0.6)
  Top 0.254: v15.56,17.5 15.68,17.38 v19.9,17.38
  Bottom 0.254: IC1.4 10.46,29.46 11.6,29.46 11.7,29.56 14.1,29.56 14.86,28.8 14.9,28.8 14.94,28.76 14.94,28.2 14.2,27.46 14.2,25.36 15.92,23.64 15.92,17.94 15.56,17.58 v15.56,17.5 | v19.9,17.38 19.13,18.15 R14.1
N$6  (via drill 0.6)
  Top 0.254: v15,19.12 18.74,19.12 20.14,20.52 23.38,20.52 23.8,20.94 30.98,20.94 31.5,21.46 v31.8,21.46
  Bottom 0.254: IC1.5 10.46,28.18 12.68,28.18 13.64,27.22 13.64,25.04 15.32,23.36 15.32,19.32 15.12,19.12 v15,19.12 | v31.8,21.46 31.44,21.1 R15.1
N$7  (via drill 0.6)
  Top 0.254: v14.14,20.2 14.18,20.24 18.92,20.24 19.82,21.14 23,21.14 23.44,21.58 30.22,21.58 31.08,22.44 32.56,22.44 33.92,21.08 42.08,21.08 42.56,21.56 42.56,21.84 43.22,22.5 44.62,22.5 45,22.12 v45.18,22.12
  Bottom 0.254: IC1.6 10.41,26.8 12.38,26.8 13.08,26.1 13.08,24.9 13.12,24.86 13.12,24.54 14.64,23.02 14.64,20.62 14.22,20.2 v14.14,20.2 | v45.18,22.12 45.18,20.94 44.48,20.24 R16.1
N$8  (via drill 0.6)
  Top 0.254: v13.98,18.02 14.1,17.9 14.1,17.08 14.74,16.44 20.66,16.44 21.24,17.02 v57.58,17.02
  Bottom 0.254: IC1.7 10.45,25.5 11.8,25.5 12.5,24.8 12.5,24.4 13.8,23.1 13.8,21.44 13.02,20.66 13.02,19.7 13.98,18.74 v13.98,18.02 | v57.58,17.02 57.68,17.12 R17.1
N$9
  Bottom 0.254: U$1.4 123.13,86.06 121.66,86.06 121.02,85.42 121.02,82.82 121.7,82.14 U$1.6
N$10
  Bottom 0.254: R1.2 133.92,81.32 U1.1 134.86,83.14 135,83 136.75,83 R2.2
N$11
  Top 0.254: C11.2 123.88,65.79 Y1.1
  Bottom 0.254: U$2.7 116.12,64.18 120.08,64.18 121.67,65.77 Y1.1
N$12
  Top 0.254: C10.2 118.82,59 120,59 121.67,60.67 Y1.2
  Bottom 0.254: U$2.8 116.24,63.16 119.16,63.16 121.61,60.71 Y1.2
N$13  (via drill 0.6)
  Top 0.254: v10.74,21.86 11.3,21.3 14.14,21.3 14.16,21.28 14.86,21.28 15.08,21.06 18.64,21.06 19.3,21.72 22.6,21.72 23.42,22.54 v23.8,22.54 | v22.1,36.7 21.06,37.74 v18.54,37.74
  Bottom 0.254: IC2.15 10.74,16.12 v10.74,21.86 | v22.1,36.7 24.2,36.7 24.72,36.18 24.72,23.38 23.88,22.54 v23.8,22.54 | v18.54,37.74 18.48,37.68 R18.1
N$14  (via drill 0.6)
  Top 0.254: v12.82,11.78 19.18,11.78 19.78,12.38 21.34,12.38 22.76,13.8 30.2,13.8 30.54,14.14 v30.6,14.14 | v27.62,30.94 27.66,30.98 v31.6,30.98
  Bottom 0.254: IC2.1 12.82,11.34 v12.82,11.78 | v30.6,14.14 30.62,14.16 30.62,15.6 28.86,17.36 28.86,23 26.84,25.02 26.84,28.26 27.62,29.04 v27.62,30.94 | v31.6,30.98 31.44,31.14 R19.1
N$15  (via drill 0.6)
  Top 0.254: v14.34,12.8 14.58,12.38 18.16,12.38 18.76,12.98 20.86,12.98 22.4,14.52 29.4,14.52 30.04,15.16 31.5,15.16 32.84,13.82 42.18,13.82 42.38,14.02 v42.44,14.02 | v40.3,30.94 40.34,30.98 v44.06,30.98
  Bottom 0.254: IC2.2 10.56,10.35 10.56,9.64 10.76,9.44 12.8,9.44 14.34,10.98 v14.34,12.8 | v42.44,14.02 42.4,14.06 42.4,15.8 41.1,17.1 41.1,24.26 39.6,25.76 39.6,28.18 40.66,29.24 40.66,30.6 40.32,30.94 v40.3,30.94 | v44.06,30.98 43.96,31.08 R20.1
N$16  (via drill 0.6)
  Top 0.254: v13.46,14.26 13.98,13.74 14.78,13.74 15.48,13.04 17.64,13.04 18.28,13.68 20.6,13.68 22.1,15.18 28.88,15.18 29.5,15.8 31.92,15.8 33.26,14.46 41.12,14.46 41.64,14.98 43.22,14.98 44.5,13.7 54.76,13.7 55.14,14.08 v55.26,14.08 | 53.5,30.84 v53.46,30.88 57.28,30.88 v57.42,30.74
  Bottom 0.254: IC2.3 9.5,10.21 9.5,9.56 10.14,8.92 13.44,8.92 15.22,10.7 15.22,11.84 15.54,12.16 15.54,13.38 14.66,14.26 v13.46,14.26 | v55.26,14.08 55.4,14.22 55.4,16.18 54.24,17.34 54.24,29.5 53.46,30.28 v53.46,30.88 | v57.42,30.74 57.56,30.98 R21.1
N$17
  Bottom 0.254: IC2.4 8.06,9.46 9.2,8.32 13.68,8.32 15.73,10.37 R22.1
N$18  (via drill 0.6)
  Top 0.254: v15.1,8.36 15.2,8.46 30.8,8.46 30.82,8.44 v31.62,8.44
  Bottom 0.254: IC2.5 6.82,10.35 6.82,9.52 8.62,7.72 14.06,7.72 14.7,8.36 v15.1,8.36 | v31.62,8.44 R23.1
N$19  (via drill 0.6)
  Top 0.254: v16.14,7.48 16.44,7.8 30.5,7.8 30.8,7.5 33.14,7.5 34.1,8.46 v44.44,8.46
  Bottom 0.254: IC2.6 5.56,10.34 5.56,9.44 7.86,7.14 14.48,7.14 14.52,7.18 15.2,7.18 15.52,7.5 v16.14,7.48 | v44.44,8.46 44.54,8.56 R24.1
N$20  (via drill 0.6)
  Top 0.254: v15.42,5.92 15.56,6.06 16.26,6.06 17.24,7.04 30.08,7.04 30.34,6.78 33.78,6.78 34.76,7.76 43.44,7.76 43.74,7.46 45.72,7.46 46.66,8.4 v57.74,8.4
  Bottom 0.254: IC2.7 4.34,10.29 4.34,9.28 7.22,6.4 14.56,6.4 15.04,5.92 v15.42,5.92 | v57.74,8.4 57.6,8.54 R25.1
N$21  (via drill 0.6)
  Top 0.254: v143.22,72.48 143.08,72.34 141.84,72.34 140.34,70.84 v136.84,70.84
  Bottom 0.254: IC6.4 141.38,71.96 142.4,71.96 142.92,72.48 v143.22,72.48 | v136.84,70.84 136.9,70.78 136.9,67.42 136.26,66.78 IC6.17
N$22
  Bottom 0.254: U$1.3 123.07,88 121,88 120,87 120,81 120.86,80.14 U$1.7
N$23
  Bottom 0.254: U$1.1 126.28,95.21 JP1.1
N$27  (via drill 0.6)
  Top 0.254: v7.06,66.38 7.4,66.04 11.44,66.04 11.9,65.58 58.84,65.58 59.04,65.78 v63.12,65.78
  Bottom 0.254: IC2.9 2.7,16.25 2.7,26.24 1.22,27.72 1.22,36.56 2.48,37.82 5.38,37.82 7.84,40.28 7.84,47.3 6.94,48.2 6.94,49.96 7.9,50.92 7.9,63.16 7.06,64 v7.06,66.38 | v63.12,65.78 63.78,66.44 65.4,66.44 66.61,67.64 IC3.14
N$31
  Bottom 0.254: U$2.6 116.1,64.9 117.12,64.9 117.58,65.36 117.58,66.08 117.13,66.53 | 117.13,66.53 U$2.4 | C8.1 118.39,68.7 117.84,68.7 117.44,68.3 117.44,67.16 117.13,66.85 117.13,66.53
N$32
  Bottom 0.254: IC1.9 6.16,22.91 6.16,22.5 6.34,22.32 6.34,21.7 9.32,18.71 IC2.14
ON_OFF  (via drill 0.6)
  Top 0.254: v139.9,11.08 140.74,11.92 144.24,11.92 146.16,10 146.74,10 148.52,11.78 v148.52,12.24 | v148.5,27.32 148.44,27.26 S13.2 S13.1
  Bottom 0.254: R38.2 140.04,5.76 IC5.4 139.9,8.46 v139.9,11.08 | v148.52,12.24 148.5,12.26 v148.5,27.32
PED1  (via drill 0.6)
  Top 0.254: S1.1 S1.2 | v112.86,10.98 114.72,9.12 v116.12,9.12
  Bottom 0.254: S1.2 112.86,50.65 v112.86,10.98 | v116.12,9.12 116.14,9.14 IC4.1 | R27.2 106.53,52.26 S1.1
PED2
  Top 0.254: S2.1 S2.2
  Bottom 0.254: S2.2 120.81,50.82 R29.2 120.48,50.75 120.48,15.96 118.69,14.16 IC4.3
PED3
  Top 0.254: S3.1 S3.2
  Bottom 0.254: IC4.5 121.22,13.37 123.9,16.04 125.3,16.04 128.28,19.02 128.28,48.5 126.94,49.84 126.94,52.07 S3.1 126.75,53.25 126,54 125.25,54 R31.2
PED4  (via drill 0.6)
  Top 0.254: S4.1 S4.2 | v139.28,19.98 139.12,19.82 129.58,19.82 127.94,18.18 v127.94,16.84
  Bottom 0.254: R33.2 137.94,52.45 S4.1 137.8,52.21 137.8,50.34 139.28,48.86 v139.28,19.98 | v127.94,16.84 123.77,12.66 IC4.7
RED1  (via drill 0.6)
  Top 0.254: LED13.A 20.71,60.98 v16.38,60.98 | v15.82,26.48 16.34,27 LED25.A 20.73,26.67 22.16,25.24 30.28,25.24 30.7,25.66 75.66,25.66 v77,27 | U$3.11 82.81,90.46 23.38,90.46 20.92,88 LED1.A
  Bottom 0.254: LED1.A 19.18,86.45 19.18,62 20.18,61 LED13.A | v16.38,60.98 16.76,60.6 16.76,45.66 15.56,44.46 15.56,37.02 14.7,36.16 14.7,33.9 16.4,32.2 16.4,27.6 15.82,27.02 v15.82,26.48 | LED41.A 77,12.73 v77,27 | R5.2 18.93,27 LED25.A
RED2  (via drill 0.6)
  Top 0.254: LED14.A v29.22,61 | v28.84,26.28 29.56,27 LED26.A | U$3.7 90.15,93.28 78,93.28 76.98,94.3 75.04,94.3 74.28,93.54 73.26,93.54 71.7,91.98 34.62,91.98 34.12,92.48 v33.56,92.48
  Bottom 0.254: LED14.A 33.73,61.35 32.04,63.04 32.04,86.31 LED2.A 33.73,92.31 v33.56,92.48 | v29.22,61 29.64,60.58 29.64,39.26 28.68,38.3 28.68,35.68 27.8,34.8 27.8,33.5 29.48,31.82 29.48,26.74 29.02,26.28 v28.84,26.28 | LED26.A 33.2,26.47 R11.2
RED3  (via drill 0.6)
  Top 0.254: LED15.A 46.57,60.84 v42.66,60.84 | v41.6,26.7 41.9,27 LED27.A | U$3.4 86.13,82.06 79.76,82.06 79.04,81.34 66.02,81.34 63.64,83.72 61.68,83.72 60.78,84.62 59.2,84.62 58.44,83.86 57.34,83.86 55.64,82.16 46.56,82.16 46.06,82.66 v46.06,82.76
  Bottom 0.254: LED3.A 45.22,86.49 45.22,82.66 | 45.22,82.66 45.22,62.38 46.6,61 LED15.A | v42.66,60.84 42.74,60.76 42.74,40.48 40.98,38.72 40.98,35.9 40.68,35.6 40.68,33.68 42.12,32.24 42.12,27.46 41.6,26.94 v41.6,26.7 | LED27.A 46.04,26.31 R12.2 | v46.06,82.76 45.96,82.66 45.22,82.66
RED4  (via drill 0.6)
  Top 0.254: U$3.2 82.67,80.44 80.62,80.44 79.86,79.68 64.9,79.68 62.38,82.2 59.36,82.2 58.8,82.76 v58.22,82.76
  Bottom 0.254: LED4.A 58.22,86.49 v58.22,82.76 58.22,82.26 58.22,62.32 59.54,61 LED16.A 58,59.27 58,38.2 56.24,36.44 56.24,27.04 56.89,26.39 R13.2 59.12,26.39 LED28.A
RED5  (via drill 0.6)
  Top 0.254: v17.86,80.04 20.69,80.04 LED5.A 20.73,79.45 21.66,78.52 63.54,78.52 63.9,78.88 81.61,78.88 U$3.1 | LED43.A 92.33,42.4 v18.1,42.4
  Bottom 0.254: v17.86,80.04 18.38,79.52 18.38,44.7 17.3,43.62 17.3,42.4 | v18.1,42.4 17.3,42.4 | 17.3,42.4 17.36,42.34 17.36,19.8 17.71,19.45 R14.2 20.28,19.45 LED29.A
RED6  (via drill 0.6)
  Top 0.254: LED6.A 33.63,79.9 v30.86,79.9 | U$3.10 84.63,91.18 32.04,91.18 31.08,92.14 v30.92,92.14 | v94.34,19.06 93.98,19.42 92.4,19.42 91.74,20.08 84.66,20.08 83.34,18.76 77.16,18.76 76.56,19.36 66.7,19.36 64.24,16.9 59.22,16.9 58.04,18.08 57.22,18.08 56.7,17.56 34.56,17.56 33.73,18.39 LED30.A
  Bottom 0.254: LED30.A 31.91,19 R15.2 30.71,18.53 30.28,18.96 30.28,36.94 31.34,38 31.34,79.42 v30.86,79.9 30.86,92.08 v30.92,92.14 | LED44.A 93.78,30.95 93.78,23.28 91.86,21.36 91.86,19.9 92.7,19.06 v94.34,19.06
RED7  (via drill 0.6)
  Top 0.254: LED7.A 46.71,80.02 v43.98,80.02 | LED40.A 44,21 43.62,21.38 v43.62,21.48 | U$3.5 87.77,82.96 79.26,82.96 78.56,82.26 66.82,82.26 64.4,84.68 62.08,84.68 61.38,85.38 58.6,85.38 57.9,84.68 56.84,84.68 55.06,82.9 48.38,82.9 47.82,83.46 v47.66,83.46
  Bottom 0.254: v43.98,80.02 44.44,79.56 44.44,39.42 42.82,37.8 42.82,21.42 | 42.82,21.42 42.82,19.16 43.39,18.59 R16.2 46.32,18.59 LED31.A | v43.62,21.48 43.56,21.42 42.82,21.42 | v47.66,83.46 47.52,83.32 47.52,81.74 46.73,80.95 LED7.A
RED8  (via drill 0.6)
  Top 0.254: LED8.A 59.67,79.94 v56.98,79.94 | LED32.A 61.13,17.6 63.82,17.6 64.98,18.76 64.98,20 65.18,20.2 77,20.2 77.54,19.66 82.62,19.66 83.96,21 LED45.A | U$3.3 84.41,81.24 80.02,81.24 79.36,80.58 65.46,80.58 63.14,82.9 60.52,82.9 59.96,83.46 v59.96,83.52
  Bottom 0.254: v56.98,79.94 57.24,79.68 57.24,38.8 55.58,37.14 55.58,19.56 55.69,19.45 R17.2 59.28,19.45 LED32.A | v59.96,83.52 59.73,83.29 LED8.A
RESET  (via drill 0.6)
  Top 0.254: J1.5 132.63,59.32 v139.88,59.32 | v139.38,72.08 139.32,72.14 v111.4,72.14
  Bottom 0.254: J1.5 132.95,58.94 R3.1 | v139.88,59.32 138.88,60.32 138.88,71.52 139.38,72.02 v139.38,72.08 | v111.4,72.14 112.18,71.36 U$2.29
RF_CLK
  Bottom 0.254: U$1.12 104.17,84.14 R43.2 103.95,83.43 103.74,83.22 101.31,83.22 R48.1
RF_MOSI  (via drill 0.6)
  Top 0.254: v104.02,74.6 111.84,74.6 112.94,75.7 114.72,75.7 115.4,76.38 116.6,76.38 117.62,75.36 125.8,75.36 126.8,76.36 127.82,76.36 128.36,75.82 v130.06,75.82
  Bottom 0.254: R47.1 130.08,65.73 130.06,65.75 v130.06,75.82 | v104.02,74.6 104.14,74.72 104.14,81.5 | 104.14,81.5 104.78,82.14 U$1.11 | 104.14,81.5 104.07,81.57 R44.2
RF_SHDN  (via drill 0.6)
  Top 0.254: v112.12,54.92 112.5,55.3 138.56,55.3 139.06,54.8 v139.8,54.8 | v109.5,90.1 109.62,90.22 v138.92,90.22
  Bottom 0.254: R46.1 112.88,57.23 112.88,55.82 112.12,55.06 v112.12,54.92 | v139.8,54.8 138.34,56.26 138.34,87.08 138.92,87.66 v138.92,90.22 138.84,90.14 | R45.2 104.49,90.14 U$1.15 107.25,90.1 v109.5,90.1
RF_SS_WIFI  (via drill 0.6)
  Top 0.254: v102.06,55.06 105.58,55.06 106.42,54.22 108.78,54.22 109.62,55.06 v109.76,55.06 | 102.64,76.6 v102.62,76.62 112.66,76.62 v112.7,76.58
  Bottom 0.254: R49.1 109.76,55.81 v109.76,55.06 | v102.06,55.06 102.62,55.62 v102.62,76.62 | R42.2 104.66,86.98 105.4,86.24 107.11,86.24 U$1.13 107.45,86.38 110.26,86.38 112.7,83.94 v112.7,76.58
SHDN
  Bottom 0.254: U$2.11 113,61.82 R46.2
SHIFT_OE  (via drill 0.6)
  Top 0.254: v10.52,64.76 59.3,64.76 59.54,65 62.58,65 63.06,64.52 63.36,64.52 64.02,65.18 64.62,65.18 64.96,65.52 66.18,65.52 v66.26,65.6 66.62,65.24 67.18,65.24 67.92,64.5 99.72,64.5 100.68,65.46 102.44,65.46 103.58,64.32 106.14,64.32 106.48,63.98 110.8,63.98 111.3,64.48 v111.3,64.54 | v8.12,18.16 7.94,18.34 v7.94,30.5
  Bottom 0.254: IC3.13 68.5,66.3 67.1,66.3 66.4,65.6 v66.26,65.6 | v10.52,64.76 9.22,63.46 9.22,54.6 10.08,53.74 10.08,39.2 6.56,35.68 4.58,35.68 3.18,34.28 3.18,30.26 4.02,29.42 4.74,29.42 IC1.13 6.82,29.38 v7.94,30.5 | IC2.13 8.12,16.05 v8.12,18.16 | v111.3,64.54 111.38,64.46 U$2.13
SLAVE_IN  (via drill 0.6)
  Top 0.254: JP6.2 2.08,46.62 v99.84,46.62 | v100.18,70.12 99.88,70.16 v105.84,70.16
  Bottom 0.254: 99.8,46.66 v99.84,46.62 99.84,58.42 100.14,58.72 100.14,70.08 v100.18,70.12 | v105.84,70.16 105.8,70.12 105.8,68.82 106.49,68.13 U$2.23
SLAVE_OUT  (via drill 0.6)
  Top 0.254: v109.18,68.64 109.26,68.72 v145.8,68.72
  Bottom 0.254: U$2.24 107.54,68.88 108.7,68.88 108.94,68.64 v109.18,68.64 | v145.8,68.72 146.64,67.88 146.64,46.72 146.82,46.54 JP7.2
SS_SHIFT  (via drill 0.6)
  Top 0.254: v8.1,64.68 9.08,63.7 11.24,63.7 11.6,64.06 59.74,64.06 60.02,64.34 62.24,64.34 62.9,63.68 64.48,63.68 v65,64.2 65.2,64.4 66.92,64.4 67.5,63.82 101.14,63.82 101.6,64.28 v101.6,64.32 | v6.82,19.56 6.86,19.6 v6.86,28.12 | v101.6,58.74 103.12,57.22 108.4,57.22 108.84,57.66 v109.18,57.66
  Bottom 0.254: IC3.12 67.52,65.1 67,64.58 65.58,64.58 65.2,64.2 v65,64.2 | v8.1,64.68 8.1,64.2 8.6,63.7 8.6,53.94 9.42,53.12 9.42,39.54 6.32,36.44 4.04,36.44 2.5,34.9 2.5,29.4 3.76,28.14 4.75,28.14 IC1.12 6.84,28.11 v6.86,28.12 | IC2.12 6.82,16.02 v6.82,19.56 | v101.6,64.32 v101.6,58.74 | U$2.14 110.58,59.96 110.16,59.54 110.16,58.44 109.38,57.66 v109.18,57.66
SS_WIFI
  Bottom 0.254: U$2.12 112.14,61.8 112.14,60.6 111.24,59.7 R49.2
UC_RX  (via drill 0.6)
  Top 0.254: v112,73.56 112.04,73.6 v144.04,73.6
  Bottom 0.254: U$2.30 113.02,70.46 113.02,73 112.46,73.56 v112,73.56 | v144.04,73.6 143.71,73.94 IC6.1
UC_TX  (via drill 0.6)
  Top 0.254: v113.7,74.68 114.16,74.22 142.52,74.22 143.16,74.86 144.96,74.86 145.44,74.38 145.44,71.64 144.72,70.92 v143.38,70.92
  Bottom 0.254: U$2.31 113.7,70.5 v113.7,74.68 | IC6.5 141.37,71.32 142.46,71.32 142.86,70.92 v143.38,70.92
UNUSED1
  Bottom 0.254: IC5.5 138.64,8.18 R39.2
UNUSED2
  Bottom 0.254: IC5.6 137.42,8.23 137.42,6.74 136.82,6.14 R40.2
UNUSED3
  Bottom 0.254: IC5.7 136.16,8.24 136.16,6.76 135,5.6 R41.2
UP  (via drill 0.6)
  Top 0.254: R35.2 105.38,28.34 104.75,27.71 S9.1 S9.2 | v143.8,10.62 142.94,9.76 124.02,9.76 123.76,10.02 117.08,10.02 114.98,12.12 112.56,12.12 111.72,11.28 v106.5,11.28
  Bottom 0.254: IC5.1 143.8,8.37 v143.8,10.62 | v106.5,11.28 106.44,11.34 106.44,25.74 104.92,27.26 S9.1
VEH1  (via drill 0.6)
  Top 0.254: S5.1 S5.2 110.17,43.34 R26.2 | v109.68,3.62 110.9,2.4 v116.22,2.4
  Bottom 0.254: S5.2 109.68,40.69 v109.68,3.62 | v116.22,2.4 117.42,3.6 IC4.15
VEH2
  Top 0.254: S6.1 S6.2 122.25,43.98 R28.2
  Bottom 0.254: S6.1 117.42,40.59 IC4.2
VEH3
  Top 0.254: S7.2 S7.1 126.75,43.92 R30.2
  Bottom 0.254: S7.1 125.16,40.67 125.16,18.7 119.95,13.49 IC4.4
VEH4  (via drill 0.6)
  Top 0.254: S8.1 140,42.26 | 140,42.26 S8.2 | v148.02,9.18 147.92,9.08 v123,9.08 | R32.2 140,44.01 140,42.26
  Bottom 0.254: S8.2 145.82,40.69 145.82,16.94 147.62,15.14 147.62,9.88 148.02,9.48 v148.02,9.18 | v123,9.08 122.5,9.59 IC4.6

## Text on the board
Top: DM-402 | Evan Green / v1 9/2013
Bottom: Evan Green / v1 9/2013
tPlace: DM-402 | 1 | 2 | 3 | 4 | Primary Interval | In | Out | 5V | Ped Interval | MOSI | MISO | Walk | SCK | Min / Green | Veh | SS_IN | GND | 1 | 2 | 3 | 4 | Passage | Ped / Clear | Ped | Prog | Set / Mem | Set / Time | Run/ / Stop | 1 | 2 | 3 | 4 | 1 | 2 | 3 | 4 | On | Max | Gap / Out | Red / Rest | R/Y / Flash | Red / Flash | Sig / Strn | Next | 5 | 6 | 7 | 8 | Exit | Yellow | Max / Out | Up | Next | Power | Veh Call | Enter/ / Menu | Ped Call | Red / Clear | Rest | Down